# Altium schematic sheet external_ports.SchDoc
size A4; SheetNumber: 10; SheetTotal: 11
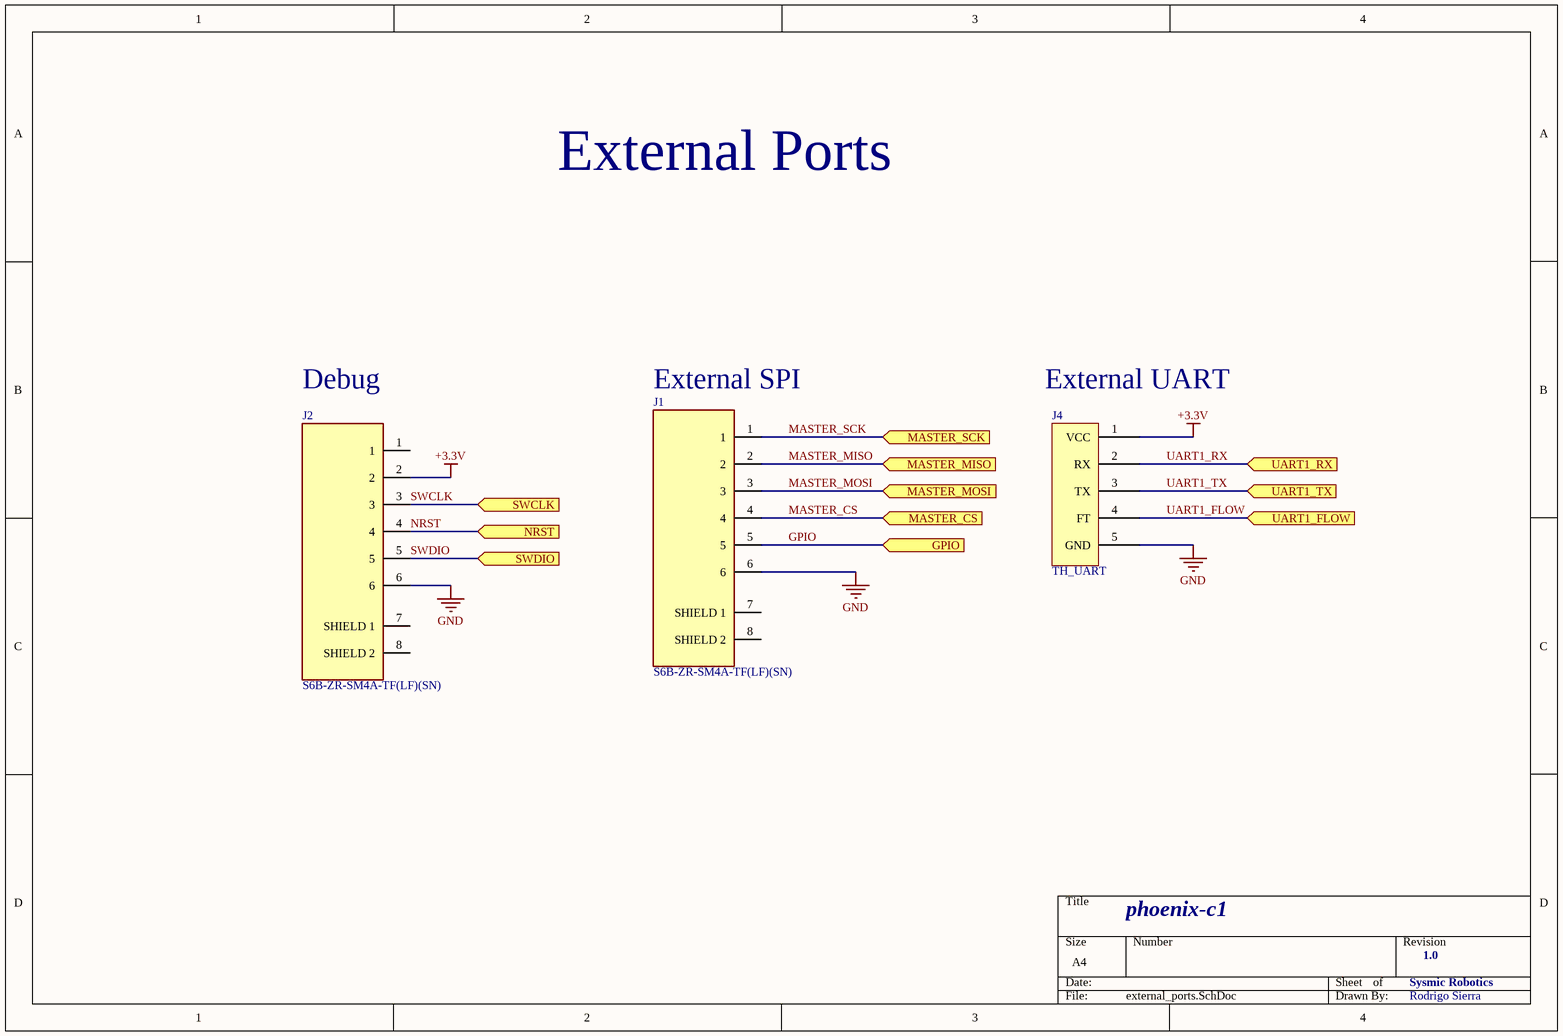
[diagram p0: external_ports.SchDoc]

## Parts
J1  S6B-ZR-SM4A-TF(LF)(SN)  [FP-S6B-ZR-SM4A-TF_LF_SN-MFG]
J2  S6B-ZR-SM4A-TF(LF)(SN)  [FP-S6B-ZR-SM4A-TF_LF_SN-MFG]
J4  TH_UART  [CONN - TH_UART]

## Ports
GPIO (in, see phoenix-c1-sch[2B], stm32g4[1D]), MASTER_CS (in, see phoenix-c1-sch[2B], stm32g4[1C]), MASTER_MISO (in, see phoenix-c1-sch[2B], stm32g4[1B]), MASTER_MOSI (in, see phoenix-c1-sch[2B], stm32g4[1B]), MASTER_SCK (in, see phoenix-c1-sch[2B], stm32g4[1B]), NRST (in, see phoenix-c1-sch[2B], stm32g4[1C]), SWCLK (in, see phoenix-c1-sch[2B], stm32g4[1C]), SWDIO (in, see phoenix-c1-sch[2B], stm32g4[1C]), UART1_FLOW (in, see phoenix-c1-sch[2B], stm32g4[1B]), UART1_RX (in, see phoenix-c1-sch[2B], stm32g4[1B]), UART1_TX (in, see phoenix-c1-sch[2B], stm32g4[1B])

## Nets
+3.3V: J2.2 J4.1(VCC)
GND: J1.6 J2.6 J4.5(GND)
GPIO: J1.5 ; port GPIO
MASTER_CS: J1.4 ; port MASTER_CS
MASTER_MISO: J1.2 ; port MASTER_MISO
MASTER_MOSI: J1.3 ; port MASTER_MOSI
MASTER_SCK: J1.1 ; port MASTER_SCK
NRST: J2.4 ; port NRST
SWCLK: J2.3 ; port SWCLK
SWDIO: J2.5 ; port SWDIO
UART1_FLOW: J4.4(FT) ; port UART1_FLOW
UART1_RX: J4.2(RX) ; port UART1_RX
UART1_TX: J4.3(TX) ; port UART1_TX

Not connected (* = marked no-connect by the designer): J1 7(SHIELD_1) 8(SHIELD_2); J2 1 7(SHIELD_1) 8(SHIELD_2)

## Notes on the sheet
- External Ports
- Debug
- (near J1) External SPI
- (near J4) External UART
- phoenix-c1
- Sysmic Robotics
- 1.0
- Rodrigo Sierra

## Library data of the parts
J1 J2 = CMP-17439-000151-1: CONN HEADER SMD R/A 6POS 1.5MM; Max Voltage Rating (DC): 50V; Number of Contacts: 6; Current Rating: 1A; Gender: Male; Contact Resistance: 30mR; Mount: Surface Mount; Lead Free: Lead Free; Height: 7.2mm; Contact Finish - Mating: TIN; Contact Type: Male Pin; Contact Shape: Circular; Insulation Material: Nylon; Contact Material: Brass; Pitch: 1.5mm; Flammability Rating: UL94 V-0; Termination: Solder; Depth: 6.5mm; Housing Color: Beige; Min Operating Temperature: -25°C; Connector Type: Header; Length: 12mm; Housing Material: Polyamide; Fastening Type: Detent; Insulation Color: Natural; Max Voltage Rating (AC): 50V; Orientation: Right Angle; Number of Positions: 6; Max Operating Temperature: 85°C; Voltage Rating: 50V; Max Current Rating: 1A; Series: ZH; Color: Natural; Width: 3.5mm; Number of Rows: 1; Packaging: Tape and Reel; Contact Plating: Copper; Supplier 1: Mouser; Supplier Part Number 1: 306-S6BZRSM4ATFLFSN